# Altium schematic sheet Sheet1.SchDoc
size A3; SheetNumber: 1; SheetTotal: 1
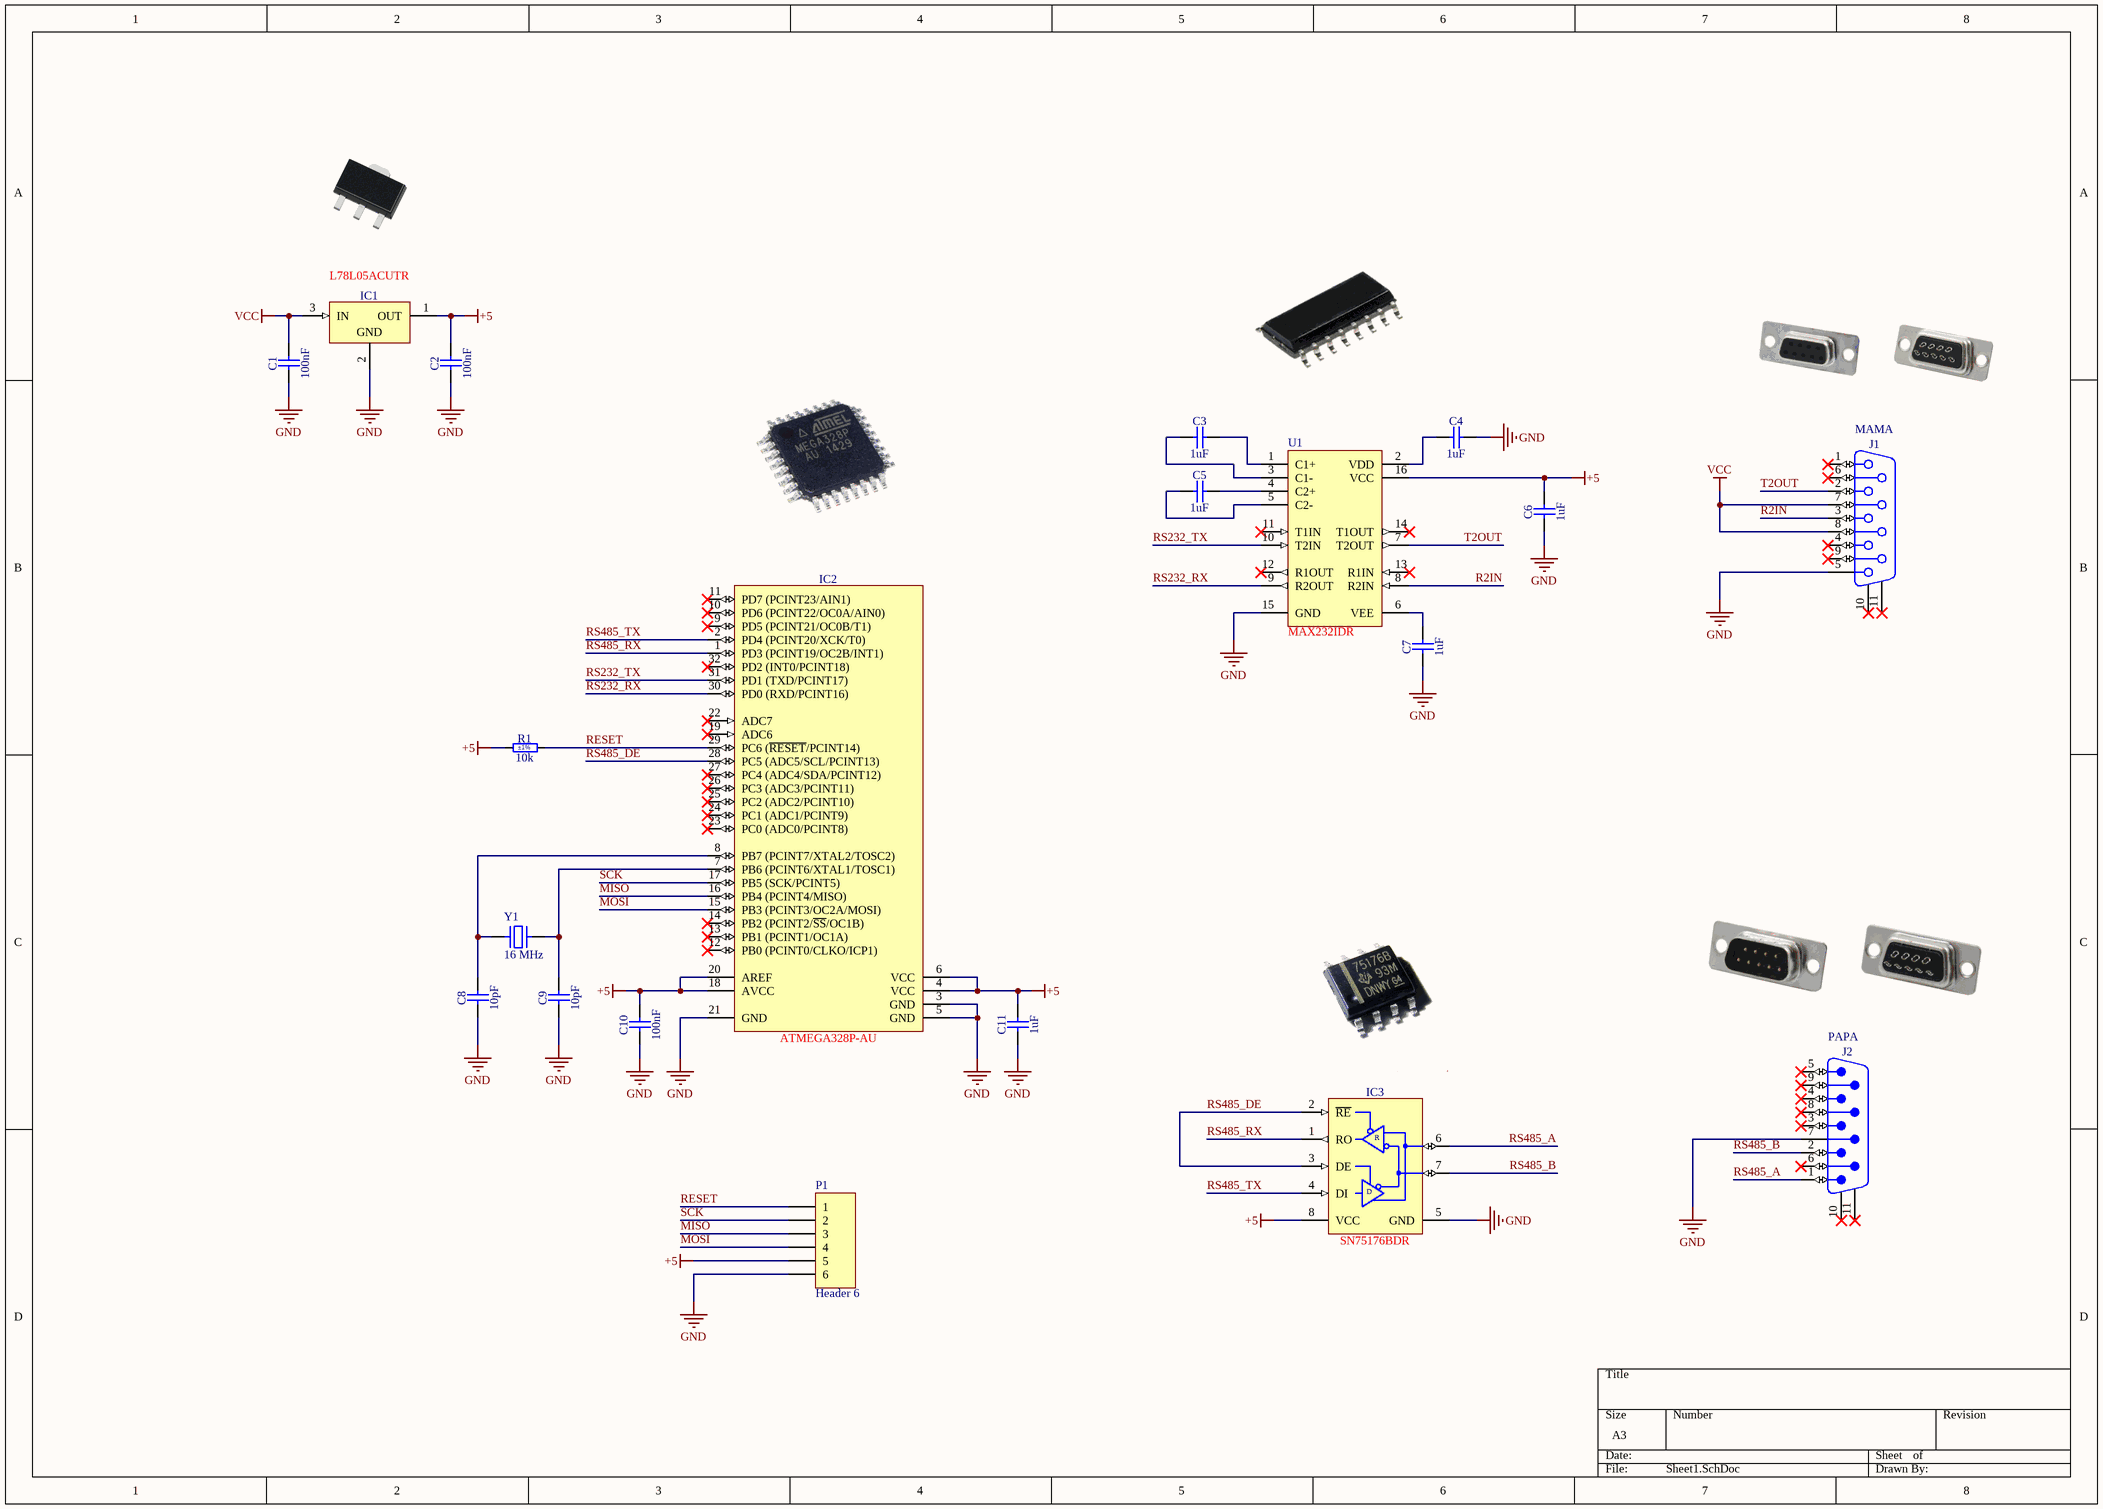
[diagram p0: Sheet1.SchDoc]

## Parts
C1  100nF  [CAPC2012X135N]
C2  100nF  [CAPC2012X135N]
C3  1uF  [CAPC2012X140N]
C4  1uF  [CAPC2012X140N]
C5  1uF  [CAPC2012X140N]
C6  1uF  [CAPC2012X140N]
C7  1uF  [CAPC2012X140N]
C8  10pF  [CAPC2012X135N]
C9  10pF  [CAPC2012X135N]
C10  100nF  [CAPC2012X135N]
C11  1uF  [CAPC2012X140N]
IC1  L78L05ACUTR  [SOT89]
IC2  ATMEGA328P-AU  [QFP80P900X900X120-32N]
IC3  SN75176BDR  [SOIC127P600X175-8N]
J1  D-Sub 9F  [D-Sub]  (value not drawn)
J2  D-Sub 9M  [D-Sub]  (value not drawn)
P1  Header 6  [HDR1X6]
R1  10k  Tolerance: ±1%  [RESC2012X60N]
U1  MAX232IDR  [SOIC-16 9.9X3.9MM P1.27MM]
Y1  16 MHz  [NDK NX5032GA]

## Nets
+5: C2.2 C6.2 C10.2 C11.2 IC1.1(OUT) IC2.4(VCC) IC2.6(VCC) IC2.18(AVCC) IC2.20(AREF) IC3.8(VCC) P1.5 R1.1 U1.16(VCC)
GND: C1.1 C2.1 C4.2 C6.1 C7.1 C8.1 C9.1 C10.1 C11.1 IC1.2(GND) IC2.3(GND) IC2.5(GND) IC2.21(GND) IC3.5(GND) J1.5 J2.7 P1.6 U1.15(GND)
VCC: C1.2 IC1.3(IN) J1.7 J1.8
MISO: IC2.16(PB4_(PCINT4/MISO)) P1.3
MOSI: IC2.15(PB3_(PCINT3/OC2A/MOSI)) P1.4
R2IN: J1.3 U1.8(R2IN)
RESET: IC2.29(PC6_(~{RESET}/PCINT14)) P1.1 R1.2
RS232_RX: IC2.30(PD0_(RXD/PCINT16)) U1.9(R2OUT)
RS232_TX: IC2.31(PD1_(TXD/PCINT17)) U1.10(T2IN)
RS485_A: IC3.6(A) J2.1
RS485_B: IC3.7(B) J2.2
RS485_DE: IC2.28(PC5_(ADC5/SCL/PCINT13)) IC3.2(~{RE}) IC3.3(DE)
RS485_RX: IC2.1(PD3_(PCINT19/OC2B/INT1)) IC3.1(RO)
RS485_TX: IC2.2(PD4_(PCINT20/XCK/T0)) IC3.4(DI)
SCK: IC2.17(PB5_(SCK/PCINT5)) P1.2
T2OUT: J1.2 U1.7(T2OUT)
NetC3_1: C3.1 U1.3(C1-)
NetC3_2: C3.2 U1.1(C1+)
NetC4_1: C4.1 U1.2(VDD)
NetC5_1: C5.1 U1.5(C2-)
NetC5_2: C5.2 U1.4(C2+)
NetC7_2: C7.2 U1.6(VEE)
NetC8_2: C8.2 IC2.8(PB7_(PCINT7/XTAL2/TOSC2)) Y1.2
NetC9_2: C9.2 IC2.7(PB6_(PCINT6/XTAL1/TOSC1)) Y1.1

Not connected (* = marked no-connect by the designer): IC2 9(PD5_(PCINT21/OC0B/T1))* 10(PD6_(PCINT22/OC0A/AIN0))* 11(PD7_(PCINT23/AIN1))* 12(PB0_(PCINT0/CLKO/ICP1))* 13(PB1_(PCINT1/OC1A))* 14(PB2_(PCINT2/~{SS}/OC1B))* 19(ADC6)* 22(ADC7)* 23(PC0_(ADC0/PCINT8))* 24(PC1_(ADC1/PCINT9))* 25(PC2_(ADC2/PCINT10))* 26(PC3_(ADC3/PCINT11))* 27(PC4_(ADC4/SDA/PCINT12))* 32(PD2_(INT0/PCINT18))*; J1 1* 4* 6* 9* 10* 11*; J2 3* 4* 5* 6* 8* 9* 10* 11*; U1 11(T1IN)* 12(R1OUT)* 13(R1IN)* 14(T1OUT)*

## Notes on the sheet
- (near J1) MAMA
- (near J2) PAPA
- (in symbol MAX3485CSA+) R; D

## Library data of the parts
C1 C2 C10 = CC0805_100NF_50V_10%_X7R: Non-polarised capacitor; Part Description: SMD Multilayer Chip Ceramic Capacitor; Manufacturer: GENERIC; Manufacturer1 Part Number: C2012X7R1H104K085; Voltage: 50V; TC: X7R; Tolerance: ±10%; Part Number: CC0805_100NF_50V_10%_X7R; Component Kind: Standard; Component Type: Standard; Pin Count: 2; Value: 100nF; Status: Preferred; Manufacturer Part Number: CC0805_100NF_50V_10%_X7R; Case: 0805; Mounted: Yes; Socket: No; SMD: Yes; Sense: No; Manufacturer1 Example: TDK; Manufacturer1 ComponentHeight: 1mm; HelpURL: \\cern.ch\dfs\Applications\Altium\Datasheets\CC0805_X7R_TDK_C.pdf; Author: CERN DEM JLC; CreateDate: 03.12.2007; LatestRevisionDate: 22.04.2015
C3-C7 C11 = CC0805_1UF_25V_10%_X7R: Non-polarised capacitor; Part Description: SMD Multilayer Chip Ceramic Capacitor; Manufacturer: GENERIC; Manufacturer1 Part Number: C0805C105K3RAC; Voltage: 25V; TC: X7R; Tolerance: ±10%; Part Number: CC0805_1UF_25V_10%_X7R; Component Kind: Standard; Component Type: Standard; Pin Count: 2; Value: 1uF; Status: Preferred; Manufacturer Part Number: CC0805_1UF_25V_10%_X7R; Case: 0805; Mounted: Yes; Socket: No; SMD: Yes; Sense: No; Manufacturer1 Example: KEMET; Manufacturer1 ComponentHeight: 1.4mm; HelpURL: \\cern.ch\dfs\Applications\Altium\Datasheets\CC0805_X7R_KEMET.pdf; Author: CERN DEM JLC; CreateDate: 23.03.2009; LatestRevisionDate: 23.03.2009
C8 C9 = CC0805_10PF_50V_1%_NP0: Non-polarised capacitor; Part Description: SMD Multilayer Chip Ceramic Capacitor; Manufacturer: GENERIC; Manufacturer1 Part Number: 223886118109; Voltage: 50V; TC: C0G/NP0; Tolerance: ±1%; Part Number: CC0805_10PF_50V_1%_NP0; Component Kind: Standard; Component Type: Standard; Pin Count: 2; Value: 10pF; Status: None; Manufacturer Part Number: CC0805_10PF_50V_1%_NP0; Case: 0805; Mounted: Yes; Socket: No; SMD: Yes; Sense: No; Manufacturer1 Example: PHYCOMP; Manufacturer1 ComponentHeight: 1.35mm; HelpURL: \\cern.ch\dfs\Applications\Altium\Datasheets\CC0805_NP0_PHYCOMP.pdf; Author: CERN DEM MR; CreateDate: 31.05.2016; LatestRevisionDate: 31.05.2016
IC1 = L78L05ACUTR: 49dB@(120Hz) 100mA 1.7V@(40mA) Fixed 5V~5V Positive 1 30V SOT-89(SOT-89-3) Linear Voltage Regulators (LDO) ROHS; Part Description: 5V 100mA Positive Voltage Regulator; Manufacturer: ST MICROELECTRONICS; PressFit: No; Bonding: No; Part Number: L78L05ACUTR; Component Kind: Standard; Component Type: Standard; Device: L78L05ACUTR; PackageDescription: SOT89-3, 3-Leads, Body 2.44x4.5mm; Manufacturer Part Number: L78L05ACUTR; Pin Count: 4; Case: SOT89; Mounted: Yes; Socket: No; SMD: Yes; Sense: No; ComponentHeight: 1.6mm; HelpURL: \\cern.ch\dfs\Applications\Altium\Datasheets\L78L05ACUTR.pdf; Author: CERN DEM JLC; CreateDate: 10.10.2011; LatestRevisionDate: 06.12.2011
IC2 = ATMEGA328P-AU: 8-bit AVR Microcontroller, 32KB Flash, 1KB EEPROM, 2KB SRAM, 32-Pin TQFP; Part Description: 8-bit AVR Microcontroller, 32KB Flash, 1KB EEPROM, 2KB SRAM, 32-Pin TQFP, Industrial Grade (-40°C to 85°C); Manufacturer: ATMEL; PressFit: No; Bonding: No; Part Number: ATMEGA328P-AU; Component Kind: Standard; Component Type: Standard; Device: ATMEGA328P-AU; PackageDescription: QFP, 0.80mm Pitch, Square; 32 Pin, 7.00mm L X 7.00mm W X 1.20mm H body, IPC Medium Density; Manufacturer Part Number: ATMEGA328P-AU; Pin Count: 32; Case: QFP32; Mounted: Yes; Socket: No; SMD: Yes; Sense: No; ComponentHeight: 1.2mm; HelpURL: \\cern.ch\dfs\Applications\Altium\Datasheets\ATMEGA328P-AU.pdf; Author: CERN DEM JLC; CreateDate: 02.07.2014; LatestRevisionDate: 02.07.2014
IC3 = MAX3485CSA+: transceiver 4.75V~5.25V 1/1 SOIC-8_150mil RS-485/RS-422 ICs ROHS; Author: CERN DEM JLC
J1 = HARTING_09 67 009 4754: Connector D-sub 9 Female; Part Description: Straight D-SUB 9 Female Contacts; PressFit: No; Part Number: HARTING_09 67 009 4754; Component Kind: Standard; Component Type: Standard; Footprint: HARTING_09 67 009 4754; Pin Count: 11; Family: D-Sub 9F; Mounted: Yes; Socket: No; SMD: No; Sense: No; Status: None; Manufacturer: HARTING; Manufacturer Part Number: 09 67 009 4754; ComponentHeight: 11.6mm; HelpURL: \\cern.ch\dfs\Applications\Altium\Datasheets\HARTING_09 67 009 4754.pdf; Author: CERN DEM BC; CreateDate: 02.09.2021; LatestRevisionDate: 02.09.2021
J2 = HARTING_09 66 162 6817: Connector D-sub 9 Male; Part Description: Right Angled D-Sub 9 Male Contacts With Grounding Board Locks And UNC 4-40 Flange Thread; PressFit: No; Part Number: HARTING_09 66 162 6817; Component Kind: Standard; Component Type: Standard; Footprint: HARTING_09 66 162 6817; Pin Count: 11; Family: D-Sub 9M; Mounted: Yes; Socket: No; SMD: No; Sense: No; Status: None; Manufacturer: HARTING; Manufacturer Part Number: 09 66 162 6817; ComponentHeight: 9.7mm; HelpURL: \\cern.ch\dfs\Applications\Altium\Datasheets\HARTING_09 66 162 6817.pdf; Author: CERN DEM HF; CreateDate: 15.10.2021; LatestRevisionDate: 15.10.2021
P1 = Header 6: Header, 6-Pin; LatestRevisionDate: 17-Jul-2002; LatestRevisionNote: Re-released for DXP Platform.; Publisher: Altium Limited
R1 = R0805_10K_1%_0.125W_100PPM: Resistor - 1%; Part Description: General Purpose Thick Film Chip Resistor; Manufacturer: GENERIC; Manufacturer1 Part Number: NRC10F1002TRF; Power: 0.125W; TC: ±100ppm/°C; PressFit: No; Part Number: R0805_10K_1%_0.125W_100PPM; Component Kind: Standard; Component Type: Standard; Pin Count: 2; Value: 10k; Status: Preferred; Manufacturer Part Number: R0805_10K_1%_0.125W_100PPM; Case: 0805; Mounted: Yes; Sense: No; Socket: No; SMD: Yes; Manufacturer1 Example: NIC COMPONENT; Manufacturer1 ComponentHeight: 0.6mm; HelpURL: \\cern.ch\dfs\Applications\Altium\Datasheets\R0805_NIC_NRC.pdf; Author: CERN DEM JLC; CreateDate: 03.12.2007; LatestRevisionDate: 13.03.2008
U1 = MAX232 (SMD): 120Kbps 4.5V~5.5V transceiver 2/2 SOIC-16 RS232 ICs ROHS; PartNumber: MAX232IDR
Y1 = NX5032GA-16MHZ-STD-CSK-4: CRYSTAL 16.0000MHZ 8PF SMD; Manufacturer: NDK America, Inc.; ESR (Equivalent Series Resistance): 50 Ohms; Frequency Stability: ±30ppm; Frequency Tolerance: ±20ppm; Operating Mode: Fundamental; Part Number: NX5032GA-16MHZ-STD-CSK-4; ComponentLink1Description: Datasheet; ComponentLink1URL: http://www.ndk.com/images/products/catalog/c_NX5032GA_e.pdf; ComponentLink2Description: DigiKey Link; ComponentLink2URL: https://www.digikey.com/en/products/detail/ndk-america-inc/NX5032GA-16MHZ-STD-CSK-4/3125646; Frequency: 16 MHz; Height - Seated (Max): 0.059" (1.50mm); LastUpdated: 07.08.2022 9:32:59; Lifecycle Status: Active; Load Capacitance: 8pF; Minimum Order: 1; Mounting Type: Surface Mount; Operating Temperature: -10°C ~ 70°C; Package / Case: 2-SMD, No Lead; Packaging: TapeAndReel; PartId: 630; Part Status: Active; Price: 0.34; Series: NX5032GA; Size / Dimension: 0.197" L x 0.126" W (5.00mm x 3.20mm); Supplier 1: DigiKey; Supplier Part Number 1: 644-1187-1-ND; Type: MHz Crystal; Value: 16 MHz